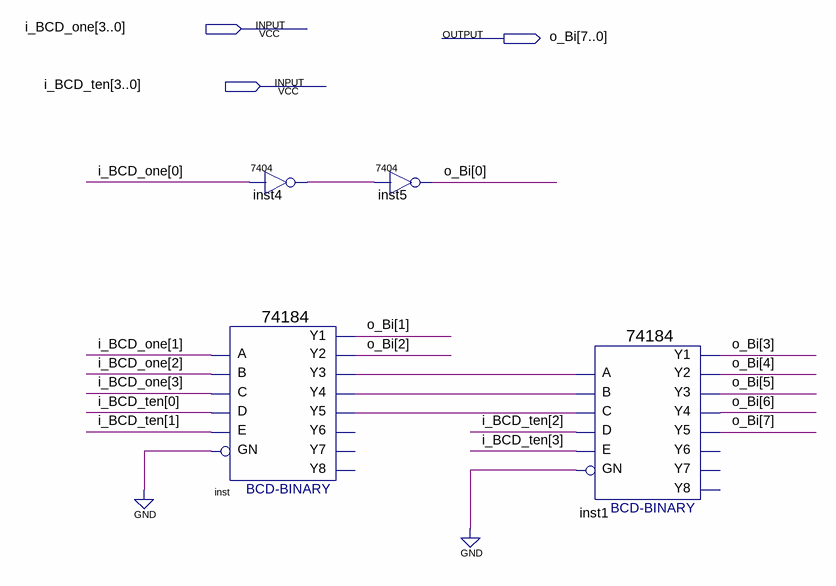
[diagram p0: schematic sheet]
// Quartus schematic bcd_binary_converter_10.bdf as structural Verilog: 4 symbols, 3 pins
module bcd_binary_converter_10 (
  input  [3:0] i_BCD_one,
  input  [3:0] i_BCD_ten,
  output [7:0] o_Bi
);

  wire inst4_1, inst_y3, inst_y4, inst_y5;

  \74184  inst (
    .D(i_BCD_ten[0]), .A(i_BCD_one[1]), .B(i_BCD_one[2]), .C(i_BCD_one[3]), .E(i_BCD_ten[1]), .GN(1'b0),
    .Y5(inst_y5), .Y3(inst_y3), .Y4(inst_y4), .Y2(o_Bi[2]), .Y1(o_Bi[1]));  // open: Y6, Y7, Y8
  \7404  inst4 (.\2 (i_BCD_one[0]), .\1 (inst4_1));
  \7404  inst5 (.\2 (inst4_1), .\1 (o_Bi[0]));
  \74184  inst1 (
    .D(i_BCD_ten[2]), .A(inst_y3), .B(inst_y4), .C(inst_y5), .E(i_BCD_ten[3]), .GN(1'b0), .Y5(o_Bi[7]),
    .Y3(o_Bi[5]), .Y4(o_Bi[6]), .Y2(o_Bi[4]), .Y1(o_Bi[3]));  // open: Y6, Y7, Y8
endmodule
